# EAGLE schematic ME433_proto_board (EAGLE 5.12)
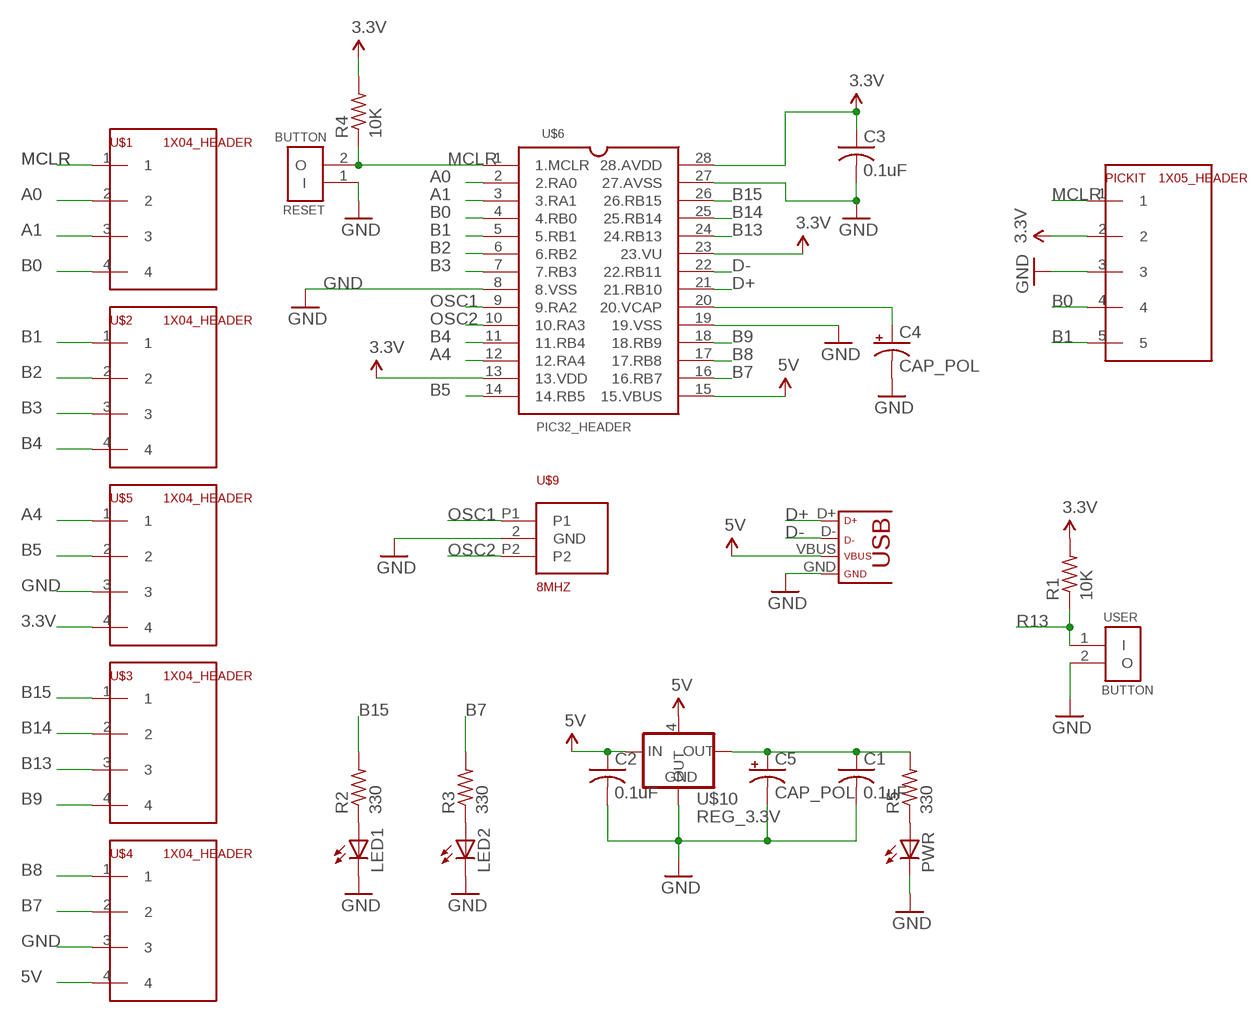
[diagram p0: schematic, sheet 1]

## Parts
C1  0.1uF  C-USC1206  [C1206]
C2  0.1uF  C-USC1206  [C1206]
C3  0.1uF  C-USC1206  [C1206]
C4  CAP_POL  [CAP_POL_D]
C5  CAP_POL  [CAP_POL_D]
LED1  LEDCHIPLED_1206  [CHIPLED_1206]
LED2  LEDCHIPLED_1206  [CHIPLED_1206]
PICKIT  1X05_HEADER  [1X05]
PWR  LEDCHIPLED_1206  [CHIPLED_1206]
R1  10K  R-US_R1206  [R1206]
R2  330  R-US_R1206  [R1206]
R3  330  R-US_R1206  [R1206]
R4  10K  R-US_R1206  [R1206]
R5  330  R-US_R1206  [R1206]
RESET  BUTTON  [BUTTON_.1]
U$1  1X04_HEADER  [1X04]
U$2  1X04_HEADER  [1X04]
U$3  1X04_HEADER  [1X04]
U$4  1X04_HEADER  [1X04]
U$5  1X04_HEADER  [1X04]
U$6  PIC32_HEADER  [HEADERS_PIC32]
U$9  8MHZ  RESONATOR_8MHZ  [RESONATOR_8MHZ]
U$10  REG_3.3V  REG_3.3V_223  [SOT223]
U$11  USB  [USB-MINIB]
USER  BUTTON  [BUTTON_.1]

## Nets
3.3V: C3.1 PICKIT.2 R1.2 R4.2 U$5.4 U$6.13(13.VDD) U$6.23(23.VU) U$6.28(28.AVDD)
5V: C2.1 U$4.4 U$6.15(15.VBUS) U$10.3(IN) U$10.4(OUT) U$11.VBUS
A0: U$1.2 U$6.2(2.RA0)
A1: U$1.3 U$6.3(3.RA1)
A4: U$5.1 U$6.12(12.RA4)
B0: PICKIT.4 U$1.4 U$6.4(4.RB0)
B1: PICKIT.5 U$2.1 U$6.5(5.RB1)
B2: U$2.2 U$6.6(6.RB2)
B3: U$2.3 U$6.7(7.RB3)
B4: U$2.4 U$6.11(11.RB4)
B5: U$5.2 U$6.14(14.RB5)
B7: R3.2 U$4.2 U$6.16(16.RB7)
B8: U$4.1 U$6.17(17.RB8)
B9: U$3.4 U$6.18(18.RB9)
B13: U$3.3 U$6.24(24.RB13)
B14: U$3.2 U$6.25(25.RB14)
B15: R2.2 U$3.1 U$6.26(26.RB15)
D+: U$6.21(21.RB10) U$11.D+
D-: U$6.22(22.RB11) U$11.D-
GND: C1.2 C2.2 C3.2 C4.2(-) C5.2(-) LED1.C LED2.C PICKIT.3 PWR.C RESET.1(I) U$4.3 U$5.3 U$6.8(8.VSS) U$6.19(19.VSS) U$6.27(27.AVSS) U$9.2(GND) U$10.1(GND) U$11.GND USER.2(O)
MCLR: PICKIT.1 R4.1 RESET.2(O) U$1.1 U$6.1(1.MCLR)
N$1: LED1.A R2.1
N$2: LED2.A R3.1
N$5: C1.1 C5.1(+) R5.2 U$10.2(OUT)
N$6: PWR.A R5.1
N$43: C4.1(+) U$6.20(20.VCAP)
OSC1: U$6.9(9.RA2) U$9.P1
OSC2: U$6.10(10.RA3) U$9.P2
R13: R1.1 USER.1(I)

## Library data of the parts
C1-C3 = ME433_Austin:C-US: CAPACITOR, American symbol
C4 C5 = ME433_Austin:CAP_POL
LED1 LED2 PWR = ME433_Austin:LED: LED OSRAM: - CHIPLED LG R971, LG N971, LY N971, LG Q971, LY Q971, LO R971, LY R971 LH N974, LH R974 LS Q976, LO Q976, LY Q976 LO Q996 - Hyper CHIPLED LW Q18S LB Q993, LB Q99A, LB R99A - SideLED LS A670, LO A670, LY A670, LG A670, LP A670 LB A673, LV A673, LT A673, LW A673 LH A674 LY A675 LS A676, LA A676, LO A676, LY A676, LW A676 LS A679, LY A679, LG A679 - Hyper Micro SIDELED® LS Y876, LA Y876, LO Y876, LY Y876 LT Y87S - SmartLED LW L88C, LW L88S LB L89C, LB L89S, LG L890 LS L89K, LO L89K, LY L89K LS L896, LA L896, LO L896, LY L896 - TOPLED LS T670, LO T670, LY T670, LG T670, LP T670 LSG T670, LSP T670, LSY T670, LOP T670, LYG T670 LG T671, LOG T671, LSG T671 LB T673, LV T673, LT T673, LW T673 LH T674 LS T676, LA T676, LO T676, LY T676, LB T676, LH T676, LSB T676, LW T676 LB T67C, LV T67C, LT T67C, LS T67K, LO T67K, LY T67K, LW E67C LS E67B, LA E67B, LO E67B, LY E67B, LB E67C, LV E67C, LT E67C LW T67C LS T679, LY T679, LG T679 LS T770, LO T770, LY T770, LG T770, LP T770 LB T773, LV T773, LT T773, LW T773 LH T774 LS E675, LA E675, LY E675, LS T675 LS T776, LA T776, LO T776, LY T776, LB T776 LHGB T686 LT T68C, LB T68C - Hyper Mini TOPLED® LB M676 - Mini TOPLED Santana® LG M470 LS M47K, LO M47K, LY M47K Source: http://www.osram.convergy.de LUXEON: - LUMILED® LXK2-PW12-R00, LXK2-PW12-S00, LXK2-PW14-U00, LXK2-PW14-V00 LXK2-PM12-R00, LXK2-PM12-S00, LXK2-PM14-U00 LXK2-PE12-Q00, LXK2-PE12-R00, LXK2-PE12-S00, LXK2-PE14-T00, LXK2-PE14-U00 LXK2-PB12-K00, LXK2-PB12-L00, LXK2-PB12-M00, LXK2-PB14-N00, LXK2-PB14-P00, LXK2-PB14-Q00 LXK2-PR12-L00, LXK2-PR12-M00, LXK2-PR14-Q00, LXK2-PR14-R00 LXK2-PD12-Q00, LXK2-PD12-R00, LXK2-PD12-S00 LXK2-PH12-R00, LXK2-PH12-S00 LXK2-PL12-P00, LXK2-PL12-Q00, LXK2-PL12-R00 Source: www.luxeon.com KINGBRIGHT: KA-3528ASYC Source: www.kingbright.com
PICKIT = ME433_Austin:1X05_HEADER
R1-R5 = ME433_Austin:R-US_: RESISTOR, American symbol
RESET USER = ME433_Austin:BUTTON
U$1-U$5 = ME433:1X04_HEADER
U$6 = ME433_Austin:PIC32_HEADER
U$9 = ME433_Austin:RESONATOR_8MHZ
U$10 = ME433_Austin:REG_3.3V_223
U$11 = ME433_Austin:USB